# EAGLE design probe_v2 (EAGLE 8.5.2)
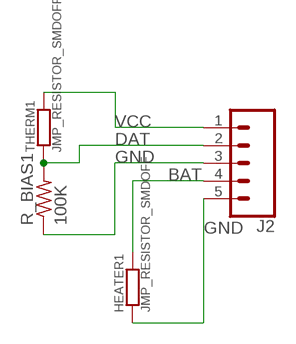
[diagram p0: schematic, sheet 1]

## Parts
HEATER1  JMP_RESISTOR_SMDOFF  [JMP_OFF_SMD]
J2  CONN_05NO_SILK  [1X05_NO_SILK]
R_BIAS1  100K  FLIPFLOP-RES  [0805-THM]
THERM1  JMP_RESISTOR_SMDOFF  [JMP_OFF_SMD]

## Nets
BAT: HEATER1.2 J2.4
DAT: J2.2 R_BIAS1.2 THERM1.1
GND: HEATER1.1 J2.3 J2.5 R_BIAS1.1
VCC: J2.1 THERM1.2

## Library data of the parts
HEATER1 THERM1 = brett:JMP_RESISTOR_SMD
J2 = SparkFun-Connectors:CONN_05: Multi connection point. Often used as Generic Header-pin footprint for 0.1 inch spaced/style header connections On any of the 0.1 inch spaced packages, you can populate with these: Break Away Headers - Straight <https://www.sparkfun.com/products/116> (PRT-00116) Break Away Male Headers - Right Angle <https://www.sparkfun.com/products/553> (PRT-00553) Female Headers <https://www.sparkfun.com/products/115> (PRT-00115) Break Away Headers - Machine Pin <https://www.sparkfun.com/products/117> (PRT-00117) Break Away Female Headers - Swiss Machine Pin <https://www.sparkfun.com/products/743> (PRT-00743) For SCREWTERMINALS and SPRING TERMINALS visit here: Screw Terimnals on SparkFun.com <https://www.sparkfun.com/search/results?term=Screw+Terminals> (5mm/3.5mm/2.54mm spacing) This device is also useful as a general connection point to wire up your design to another part of your project. Our various solder wires solder well into these plated through hole pads. Hook-Up Wire - Assortment (Stranded, 22 AWG) <https://www.sparkfun.com/products/11375> (PRT-11375) Hook-Up Wire - Assortment (Solid Core, 22 AWG) <https://www.sparkfun.com/products/11367> (PRT-11367) View the entire wire category on our website here <https://www.sparkfun.com/categories/141> Special notes: Molex polarized connector foot print use with SKU : PRT-08231 with associated crimp pins and housings. 1MM SMD Version SKU: PRT-10208
R_BIAS1 = adafruit:FLIPFLOP-RES: Flip Flop resistor An 0805 resistor inside a standard 1/4W 5% resistor. Makes for easy mods

## Board
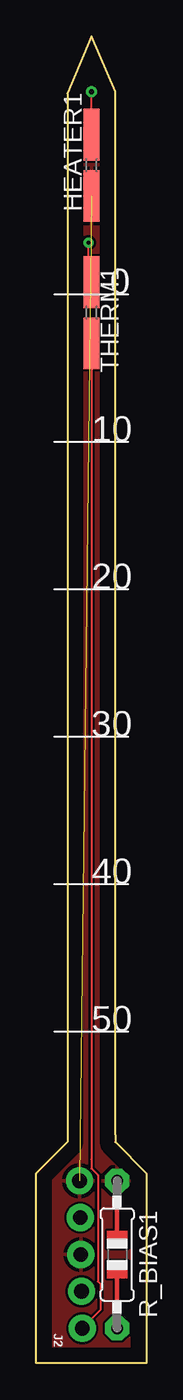
[diagram p1: board, top side]
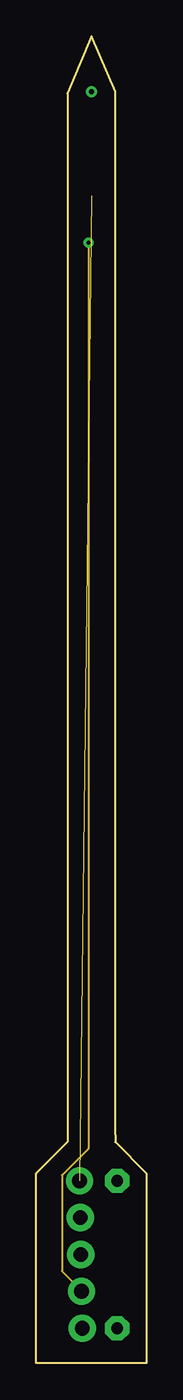
[diagram p2: board, inner layer Route2]
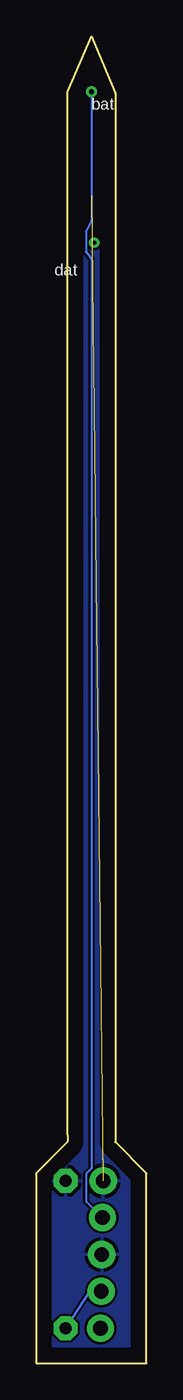
[diagram p3: board, bottom side, seen from below]

Size 7.62 x 91.44 mm. Coordinates in mm from the lower left corner, seen from the top.
Outline: 3.81,91.44 2.16,87.5 2.16,15.24 0,13.08 0,0 7.62,0 7.62,13.08 5.46,15.24 5.46,15.75 5.46,87.63 3.81,91.44
Copper layers (1*2*3*16): Top 0.0356mm / dielectric 0.24891875mm / Route2 0.0178mm / dielectric 47mil / Route3 0.0178mm / dielectric 0.24891875mm / Bottom 0.035mm
Design rules "default *": minimum track width 5mil, minimum drill 10mil, track to track 6mil, track to pad 6mil, pad to pad 6mil, via to via 6mil, smd to smd 6mil, copper to edge 40mil, drill to drill 6mil, minimum pad ring 10mil, minimum via ring 8mil, stop-mask expansion 4mil, vias tented up to drill 0mil, thermal gap 10mil
Holes 2.54 mm at -6.35,0.76

### Footprints (pad centres in the part's own frame; a part is rotated, then mirrored left to right if it is on the bottom)
JMP_OFF_SMD = smd 3.556 x 1.1: 1 -2.108,0; 2 2.108,0
1X05_NO_SILK = drill 1.016 pad 1.88: 1 0,0; 2 2.54,0; 3 5.08,0; 4 7.62,0; 5 10.16,0
0805-THM = drill 0.813 pad 1.676 octagon: 1 -5.08,0; 2 5.08,0

### Placement (x,y rotation side)
HEATER1  3.81,82.55 90 top
J2  3.18,2.41 91 top
R_BIAS1  5.59,7.49 270 top
THERM1  3.81,72.39 270 top

### Tracks (layer width: path | path; a pad name or v marks a point on that pad's centre or on a via)
BAT  (via drill 0.35)
  Top 0.152: HEATER1.2 v3.81,87.63
  Bottom 0.15: 3.81,78.74 4.19,77.98 4.19,76.58 3.81,76.07 3.81,13.42 4.17,13.06 4.17,11.16 J2.4
  Bottom 0.152: v3.81,87.63 3.81,78.74
DAT  (via drill 0.3)
  Top 0.15: THERM1.1 3.61,74.7 v3.61,77.22
  Route2 0.15: 3.18,4.95 | 3.18,4.95 J2.2 | 3.18,4.95 1.78,6.35 1.78,12.95 3.61,14.79 v3.61,77.22
  Bottom 0.127: 3.87,5.02 J2.2
  Bottom 0.15: J2.2 3.94,4.95 R_BIAS1.2
GND  (1 unrouted)
  Bottom 0.127: 3.73,7.53 J2.3
  pour Bottom: 3.81,91.44 0,87.63 0,-3.81 8.89,-3.81 8.89,87.63
  pour Top: 3.81,91.44 -1.27,87.63 -1.27,-3.81 8.89,-3.81 8.89,87.63
VCC
  Top 0.15: 3.81,14.06 3.81,13.42 4.26,12.97 4.26,5.64 4.45,5.46 4.45,3.68 J2.1
  Top 0.152: THERM1.2 3.81,14.06

### Text on the board
tPlace: 0 | 10 | 20 | 30 | 40 | 50
bPlace: bat | dat